# EAGLE design TuringMachine_singleBoard (EAGLE 6.6.0)

## Sheet 1 of 3
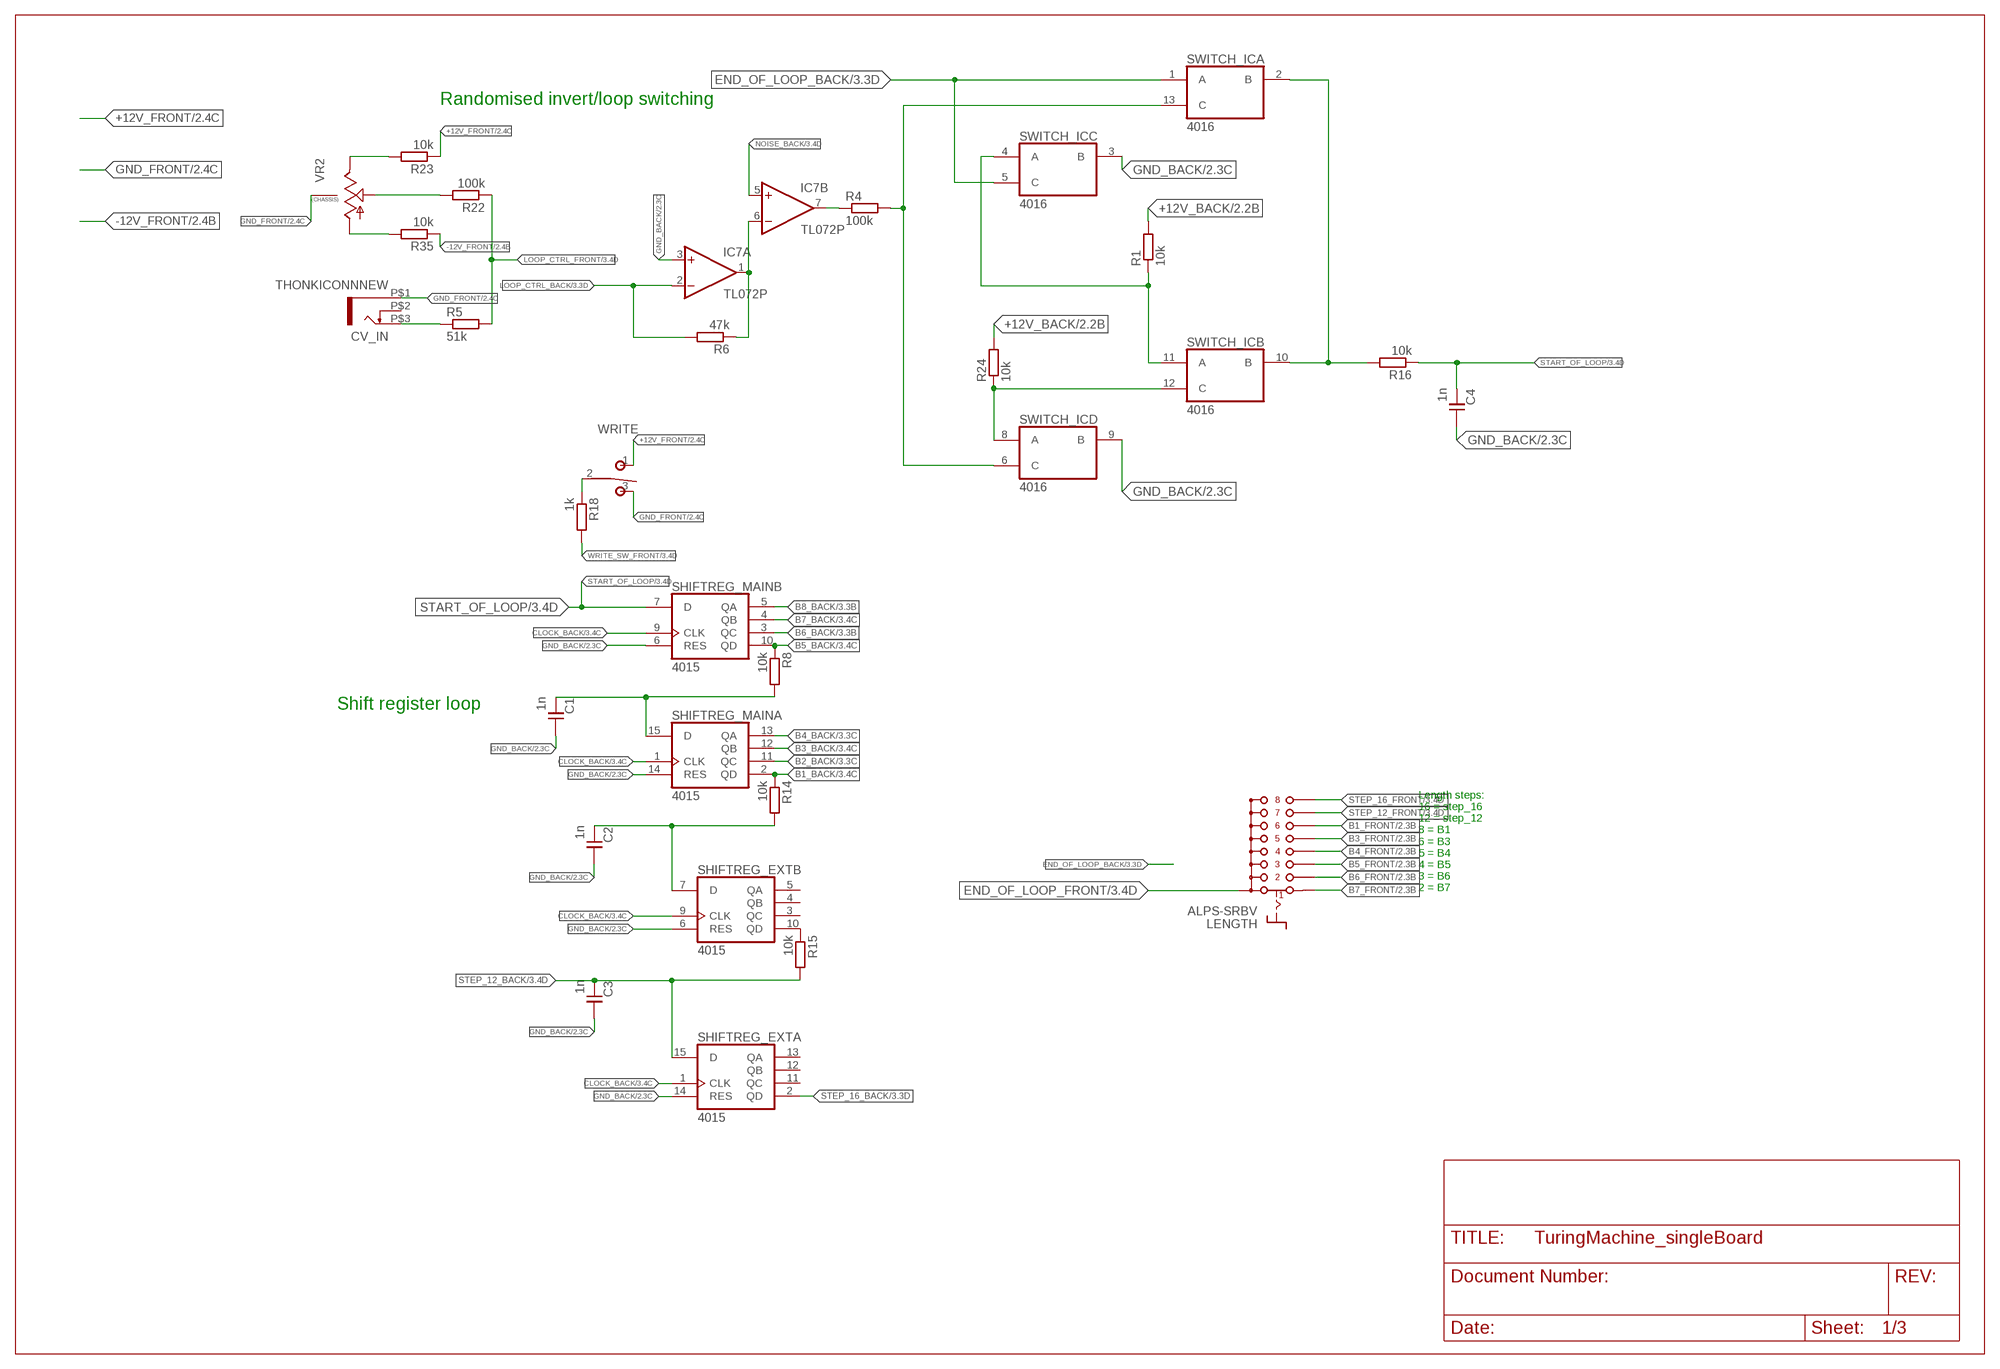
[diagram p0: schematic, sheet 1]

### Parts
C1  1n  C-EU050-024X044  [C050-024X044]
C2  1n  C-EU050-024X044  [C050-024X044]
C3  1n  C-EU050-024X044  [C050-024X044]
C4  1n  C-EU050-024X044  [C050-024X044]
CV_IN  THONKICONNNEW  [WQP-PJ301M-12_JACK]
IC7  TL072P  [DIL08]
LENGTH  ALPS-SRBV  [ALPS-SRBV]
R1  10k  R-EU_0207/7  [0207/7]
R4  100k  R-EU_0207/7  [0207/7]
R5  51k  R-EU_0207/7  [0207/7]
R6  47k  R-EU_0207/7  [0207/7]
R8  10k  R-EU_0207/7  [0207/7]
R14  10k  R-EU_0207/7  [0207/7]
R15  10k  R-EU_0207/7  [0207/7]
R16  10k  R-EU_0207/7  [0207/7]
R18  1k  R-EU_0207/7  [0207/7]
R22  100k  R-EU_0207/7  [0207/7]
R23  10k  R-EU_0207/7  [0207/7]
R24  10k  R-EU_0207/7  [0207/7]
R35  10k  R-EU_0207/7  [0207/7]
SHIFTREG_EXT  4015  4015N  [DIL16]
SHIFTREG_MAIN  4015  4015N  [DIL16]
SWITCH_IC  4016  4016N  [DIL14]
VR2  9MM_SNAP-IN_POT_CHASSIS  [9MM_SNAP-IN_POT]
WRITE  T-80-T-SPDT-ON-OFF-ON  [M9040P]

### Nets
+12V_BACK [power]: R1.2 R24.2 ; also sheet 2,3
+12V_FRONT [power]: R23.1 WRITE.1(O) ; also sheet 2,3
-12V_FRONT [power]: R35.1 ; also sheet 2,3
B1_BACK: R14.1 SHIFTREG_MAIN.2(A:QD) ; also sheet 3
B1_FRONT: LENGTH.F ; also sheet 2,3
B2_BACK: SHIFTREG_MAIN.11(A:QC) ; also sheet 3
B3_BACK: SHIFTREG_MAIN.12(A:QB) ; also sheet 3
B3_FRONT: LENGTH.E ; also sheet 2,3
B4_BACK: SHIFTREG_MAIN.13(A:QA) ; also sheet 3
B4_FRONT: LENGTH.D ; also sheet 2,3
B5_BACK: R8.1 SHIFTREG_MAIN.10(B:QD) ; also sheet 3
B5_FRONT: LENGTH.C ; also sheet 2,3
B6_BACK: SHIFTREG_MAIN.3(B:QC) ; also sheet 3
B6_FRONT: LENGTH.B ; also sheet 2,3
B7_BACK: SHIFTREG_MAIN.4(B:QB) ; also sheet 3
B7_FRONT: LENGTH.A ; also sheet 2,3
B8_BACK: SHIFTREG_MAIN.5(B:QA) ; also sheet 3
CLOCK_BACK: SHIFTREG_EXT.1(A:CLK) SHIFTREG_EXT.9(B:CLK) SHIFTREG_MAIN.1(A:CLK) SHIFTREG_MAIN.9(B:CLK) ; also sheet 3
END_OF_LOOP_BACK: SWITCH_IC.1(A:A) SWITCH_IC.5(C:C) ; also sheet 3
END_OF_LOOP_FRONT: LENGTH.COM2(A) LENGTH.COM(A) ; also sheet 3
GND_BACK [ground]: C1.1 C2.1 C3.1 C4.1 IC7.3(A:+IN) SHIFTREG_EXT.6(B:RES) SHIFTREG_EXT.14(A:RES) SHIFTREG_MAIN.6(B:RES) SHIFTREG_MAIN.14(A:RES) SWITCH_IC.3(C:B) SWITCH_IC.9(D:B) ; also sheet 2,3
GND_FRONT [ground]: CV_IN.P$1 VR2.M1 VR2.M2 WRITE.3(S) ; also sheet 2,3
LOOP_CTRL_BACK: IC7.2(A:-IN) R4.2 R6.2 SWITCH_IC.6(D:C) SWITCH_IC.13(A:C) ; also sheet 3
LOOP_CTRL_FRONT [power]: R5.2 R22.1 ; also sheet 3
N$1: IC7.7(B:OUT) R4.1
N$3: CV_IN.P$3 R5.1
N$4: R1.1 SWITCH_IC.4(C:A) SWITCH_IC.11(B:A)
N$7: IC7.1(A:OUT) IC7.6(B:-IN) R6.1
N$10: C1.2 R8.2 SHIFTREG_MAIN.15(A:D)
N$11: R18.1 WRITE.2(P)
N$14: R15.1 SHIFTREG_EXT.10(B:QD)
N$17: R16.2 SWITCH_IC.2(A:B) SWITCH_IC.10(B:B)
N$28: C2.2 R14.2 SHIFTREG_EXT.7(B:D)
N$43: R22.2 VR2.2(S)
N$45: R24.1 SWITCH_IC.8(D:A) SWITCH_IC.12(B:C)
N$47: R23.2 VR2.3(E)
N$48: R35.2 VR2.1(A)
NOISE_BACK: IC7.5(B:+IN) ; also sheet 3
START_OF_LOOP: C4.2 R16.1 SHIFTREG_MAIN.7(B:D) ; also sheet 3
STEP_12_BACK: C3.2 R15.2 SHIFTREG_EXT.15(A:D) ; also sheet 3
STEP_12_FRONT: LENGTH.G ; also sheet 3
STEP_16_BACK: SHIFTREG_EXT.2(A:QD) ; also sheet 3
STEP_16_FRONT: LENGTH.H ; also sheet 3
WRITE_SW_FRONT: R18.2 ; also sheet 3
Unconnected: CV_IN.P$2 SHIFTREG_EXT.3(B:QC) SHIFTREG_EXT.4(B:QB) SHIFTREG_EXT.5(B:QA) SHIFTREG_EXT.11(A:QC) SHIFTREG_EXT.12(A:QB) SHIFTREG_EXT.13(A:QA)

### Notes on the sheet
- Randomised invert/loop switching
- Shift register loop
- Length steps: 
  16 = step_16
  12 = step_12
  8 = B1 
  6 = B3
  5 = B4 
  4 = B5
  3 = B6
  2 = B7

## Sheet 2 of 3
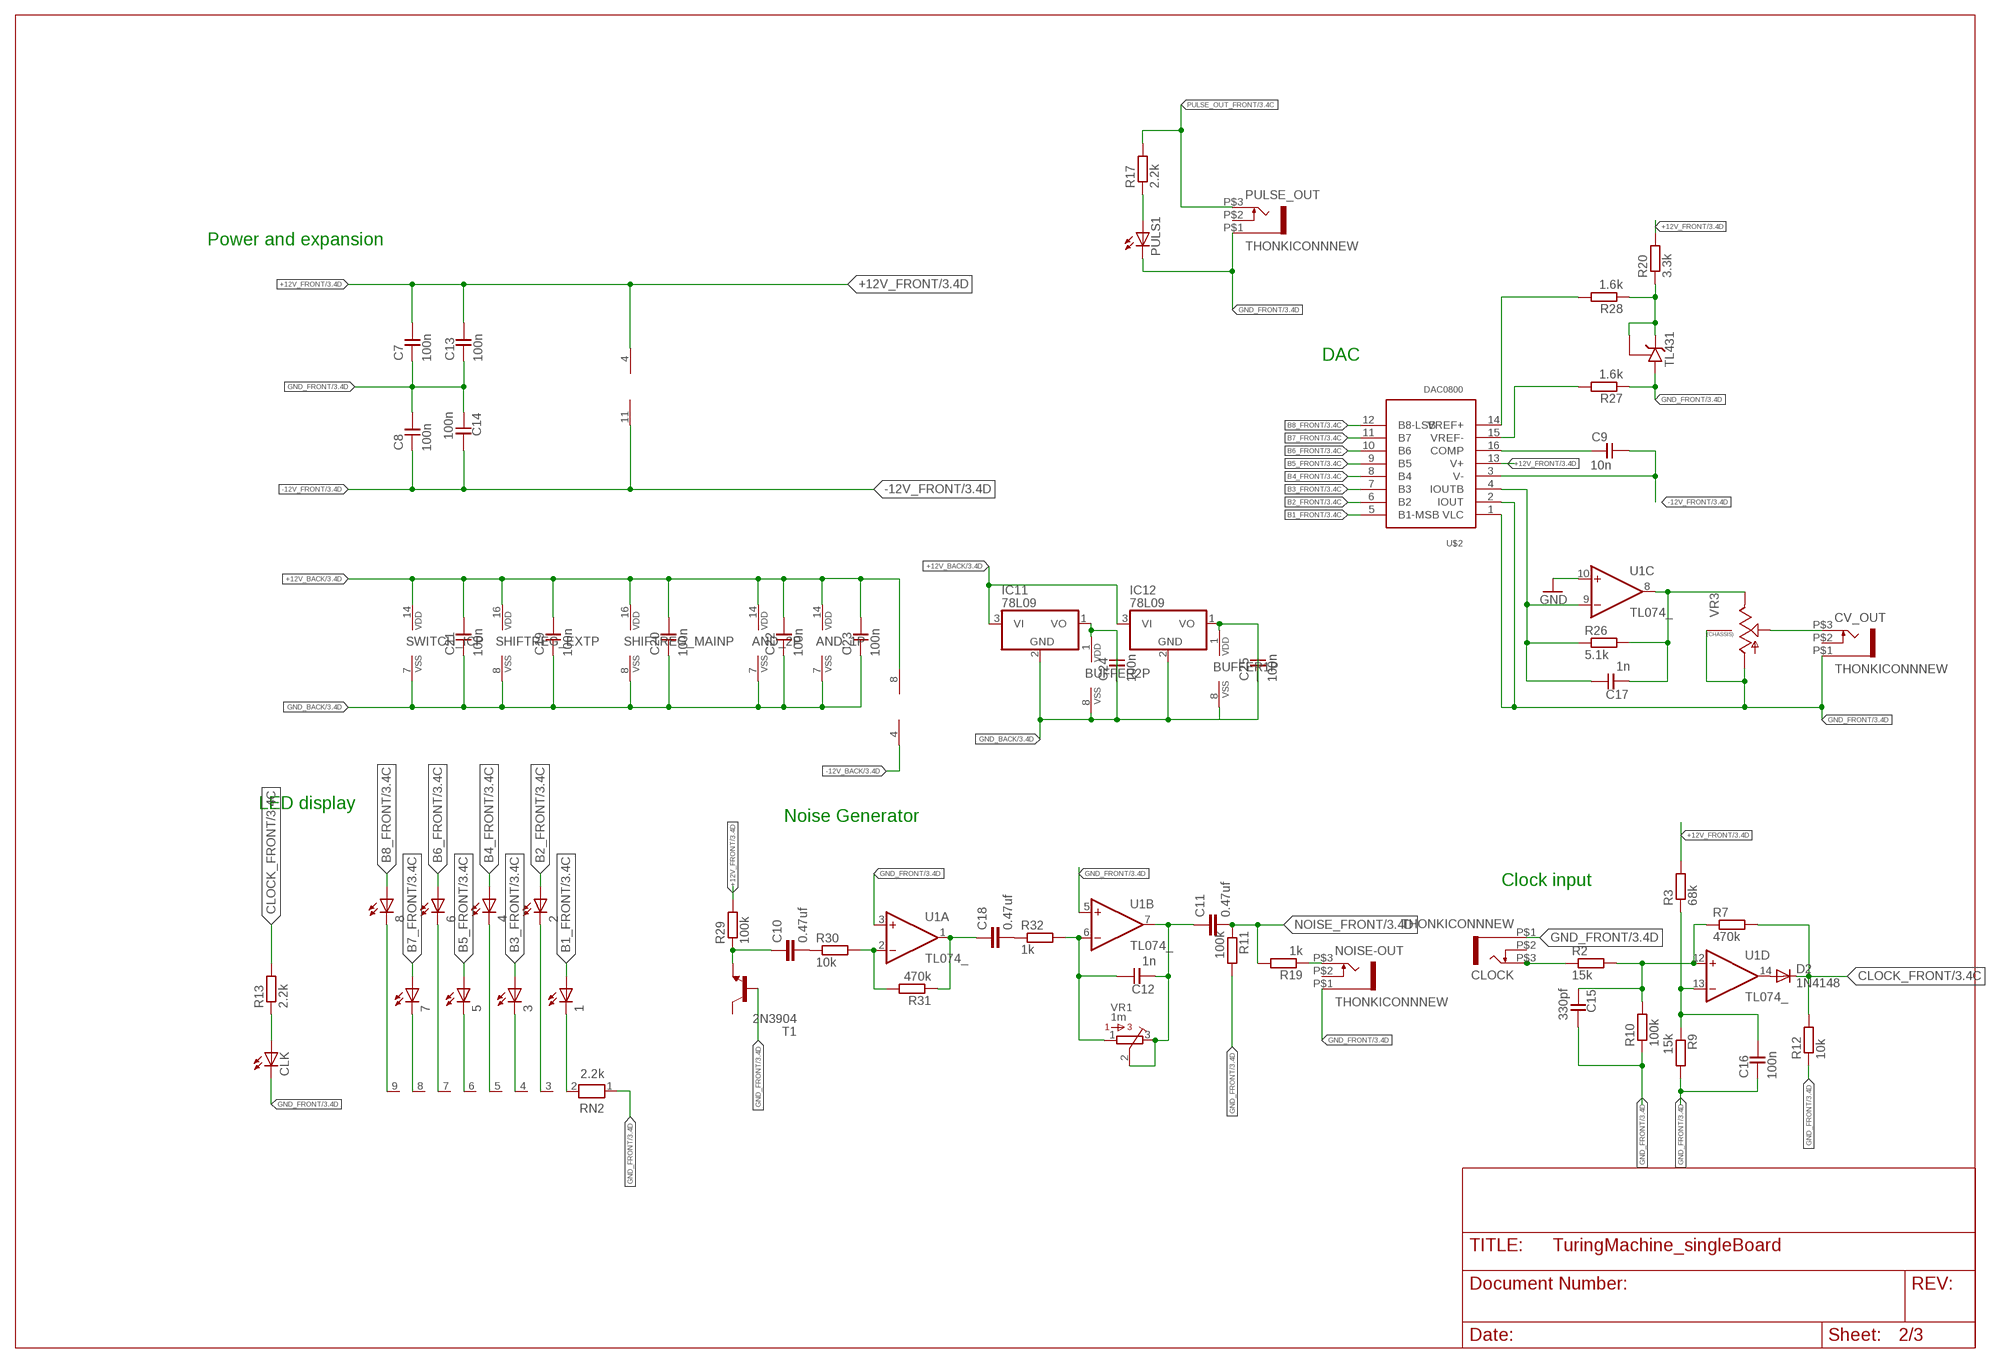
[diagram p1: schematic, sheet 2]

### Parts
1  LED3MM  [LED3MM]
2  LED3MM  [LED3MM]
3  LED3MM  [LED3MM]
4  LED3MM  [LED3MM]
5  LED3MM  [LED3MM]
6  LED3MM  [LED3MM]
7  LED3MM  [LED3MM]
8  LED3MM  [LED3MM]
AND_1  4081  4081N  [DIL14]
AND_2  4081  4081N  [DIL14]
BUFFER1  4050  4050N  [DIL16]
BUFFER2  4050  4050N  [DIL16]
C7  100n  C-EU050-024X044  [C050-024X044]
C8  100n  C-EU050-024X044  [C050-024X044]
C9  10n  C-EU050-024X044  [C050-024X044]
C10  0.47uf  C-EU050-035X075  [C050-035X075]
C11  0.47uf  C-EU050-035X075  [C050-035X075]
C12  1n  C-EU050-024X044  [C050-024X044]
C13  100n  C-EU050-024X044  [C050-024X044]
C14  100n  C-EU050-024X044  [C050-024X044]
C15  330pf  C-EU050-024X044  [C050-024X044]
C16  100n  C-EU050-024X044  [C050-024X044]
C17  1n  C-EU050-024X044  [C050-024X044]
C18  0.47uf  C-EU050-035X075  [C050-035X075]
C19  100n  C-EU050-024X044  [C050-024X044]
C20  100n  C-EU050-024X044  [C050-024X044]
C21  100n  C-EU050-024X044  [C050-024X044]
C22  100n  C-EU050-024X044  [C050-024X044]
C23  100n  C-EU050-024X044  [C050-024X044]
C24  100n  C-EU050-024X044  [C050-024X044]
C25  100n  C-EU050-024X044  [C050-024X044]
CLK  LED3MM  [LED3MM]
CLOCK  THONKICONNNEW  [WQP-PJ301M-12_JACK]
CV_OUT  THONKICONNNEW  [WQP-PJ301M-12_JACK]
D2  1N4148  SMALL_DIODEDO35-7  [DO35-7]
IC11  78L09  7808L  [TO92]
IC12  78L09  7808L  [TO92]
NOISE-OUT  THONKICONNNEW  [WQP-PJ301M-12_JACK]
PULS1  LED3MM  [LED3MM]
PULSE_OUT  THONKICONNNEW  [WQP-PJ301M-12_JACK]
R2  15k  R-EU_0207/7  [0207/7]
R3  68k  R-EU_0207/7  [0207/7]
R7  470k  R-EU_0207/7  [0207/7]
R9  15k  R-EU_0207/7  [0207/7]
R10  100k  R-EU_0207/7  [0207/7]
R11  100k  RESISTOR7MM  [7MM_RESISTOR]
R12  10k  R-EU_0207/7  [0207/7]
R13  2.2k  R-EU_0207/7  [0207/7]
R17  2.2k  R-EU_0207/7  [0207/7]
R19  1k  R-EU_0207/7  [0207/7]
R20  3.3k  R-EU_0207/7  [0207/7]
R26  5.1k  R-EU_0207/7  [0207/7]
R27  1.6k  R-EU_0207/7  [0207/7]
R28  1.6k  R-EU_0207/7  [0207/7]
R29  100k  R-EU_0207/7  [0207/7]
R30  10k  R-EU_0207/7  [0207/7]
R31  470k  R-EU_0207/7  [0207/7]
R32  1k  R-EU_0207/7  [0207/7]
RN2  2.2k  RN08  [RN-9]
T1  2N3904  [TO92]
TL431  TL431CLP  [TO92-CLP]
U1  TL074_  [DIL14]
U$2  DAC0800  [DIL16]
VR1  1m  BOURNS_3362P_TRIMMERP  [BOURNS_3362P_TRIMMER]
VR3  9MM_SNAP-IN_POT_CHASSIS  [9MM_SNAP-IN_POT]

### Nets
+9V_1 [power]: BUFFER2.1(P:VDD) C24.2 IC11.1(VO)
+9V_2 [power]: BUFFER1.1(P:VDD) C25.2 IC12.1(VO)
+12V_BACK [power]: AND_1.14(P:VDD) AND_2.14(P:VDD) C19.1 C20.1 C21.1 C22.1 C23.1 IC7.8(P:V+) IC11.3(VI) IC12.3(VI) SHIFTREG_EXT.16(P:VDD) SHIFTREG_MAIN.16(P:VDD) SWITCH_IC.14(P:VDD) ; also sheet 1,3
+12V_FRONT [power]: C7.1 C13.1 R3.2 R20.2 R29.2 U1.4(P:V+) U$2.13(V+) ; also sheet 1,3
-12V_BACK [power]: IC7.4(P:V-) ; also sheet 3
-12V_FRONT [power]: C8.2 C9.1 C14.1 U1.11(P:V-) U$2.3(V-) ; also sheet 1,3
B1_FRONT: 1.A U$2.5(B1-MSB) ; also sheet 1,3
B2_FRONT: 2.A U$2.6(B2) ; also sheet 3
B3_FRONT: 3.A U$2.7(B3) ; also sheet 1,3
B4_FRONT: 4.A U$2.8(B4) ; also sheet 1,3
B5_FRONT: 5.A U$2.9(B5) ; also sheet 1,3
B6_FRONT: 6.A U$2.10(B6) ; also sheet 1,3
B7_FRONT: 7.A U$2.11(B7) ; also sheet 1,3
B8_FRONT: 8.A U$2.12(B8-LSB) ; also sheet 3
CLOCK_FRONT: D2.C R7.2 R12.2 R13.2 ; also sheet 3
GND_BACK [ground]: AND_1.7(P:VSS) AND_2.7(P:VSS) BUFFER1.8(P:VSS) BUFFER2.8(P:VSS) C19.2 C20.2 C21.2 C22.2 C23.2 C24.1 C25.1 IC11.2(GND) IC12.2(GND) SHIFTREG_EXT.8(P:VSS) SHIFTREG_MAIN.8(P:VSS) SWITCH_IC.7(P:VSS) ; also sheet 1,3
GND_FRONT [ground]: C7.2 C8.1 C13.2 C14.2 C15.1 C16.2 CLK.K(C) CLOCK.P$1 CV_OUT.P$1 NOISE-OUT.P$1 PULS1.K(C) PULSE_OUT.P$1 R9.2 R10.1 R11.2 R12.1 R27.1 RN2.1 T1.2(B) TL431.A U1.3(A:+IN) U1.5(B:+IN) U1.10(C:+IN) U$2.1(VLC) U$2.2(IOUT) VR3.1(A) VR3.M1 VR3.M2 ; supply symbol labelled GND ; also sheet 1,3
MAIN_OUT: C17.2 R26.2 U1.8(C:OUT) VR3.3(E)
N$2: CLOCK.P$3 R2.1
N$5: C15.2 R2.2 R7.1 R10.2 U1.12(D:+IN)
N$6: PULS1.A R17.1
N$8: D2.A U1.14(D:OUT)
N$9: C18.2 R32.1
N$12: C16.1 R3.1 R9.1 U1.13(D:-IN)
N$13: C17.1 R26.1 U1.9(C:-IN) U$2.4(IOUTB)
N$15: CLK.A R13.1
N$16: C10.1 R29.1 T1.3(E)
N$18 [power]: R20.1 R28.1 TL431.C TL431.R
N$20: C10.2 R30.1
N$21: R30.2 R31.2 U1.2(A:-IN)
N$22: C18.1 R31.1 U1.1(A:OUT)
N$23: R27.2 U$2.15(VREF-)
N$25: C9.2 U$2.16(COMP)
N$26: R28.2 U$2.14(VREF+)
N$27: C12.1 R32.2 U1.6(B:-IN) VR1.1
N$30: 8.K(C) RN2.9
N$31: 7.K(C) RN2.8
N$32: 6.K(C) RN2.7
N$33: 5.K(C) RN2.6
N$34: 4.K(C) RN2.5
N$35: 3.K(C) RN2.4
N$36: 2.K(C) RN2.3
N$37: 1.K(C) RN2.2
N$39: CV_OUT.P$3 VR3.2(S)
N$40: NOISE-OUT.P$3 R19.1
N$41: C11.1 C12.2 U1.7(B:OUT) VR1.2 VR1.3
NOISE_FRONT: C11.2 R11.1 R19.2 ; also sheet 3
PULSE_OUT_FRONT: PULSE_OUT.P$3 R17.2 ; also sheet 3
Unconnected: CLOCK.P$2 CV_OUT.P$2 NOISE-OUT.P$2 PULSE_OUT.P$2 T1.1(C)

### Notes on the sheet
- Power and expansion
- DAC
- LED display
- Noise Generator
- Clock input
- /Users/aash/Dropbox/Electronics/!MODULAR/design/logo copy.bmp

## Sheet 3 of 3
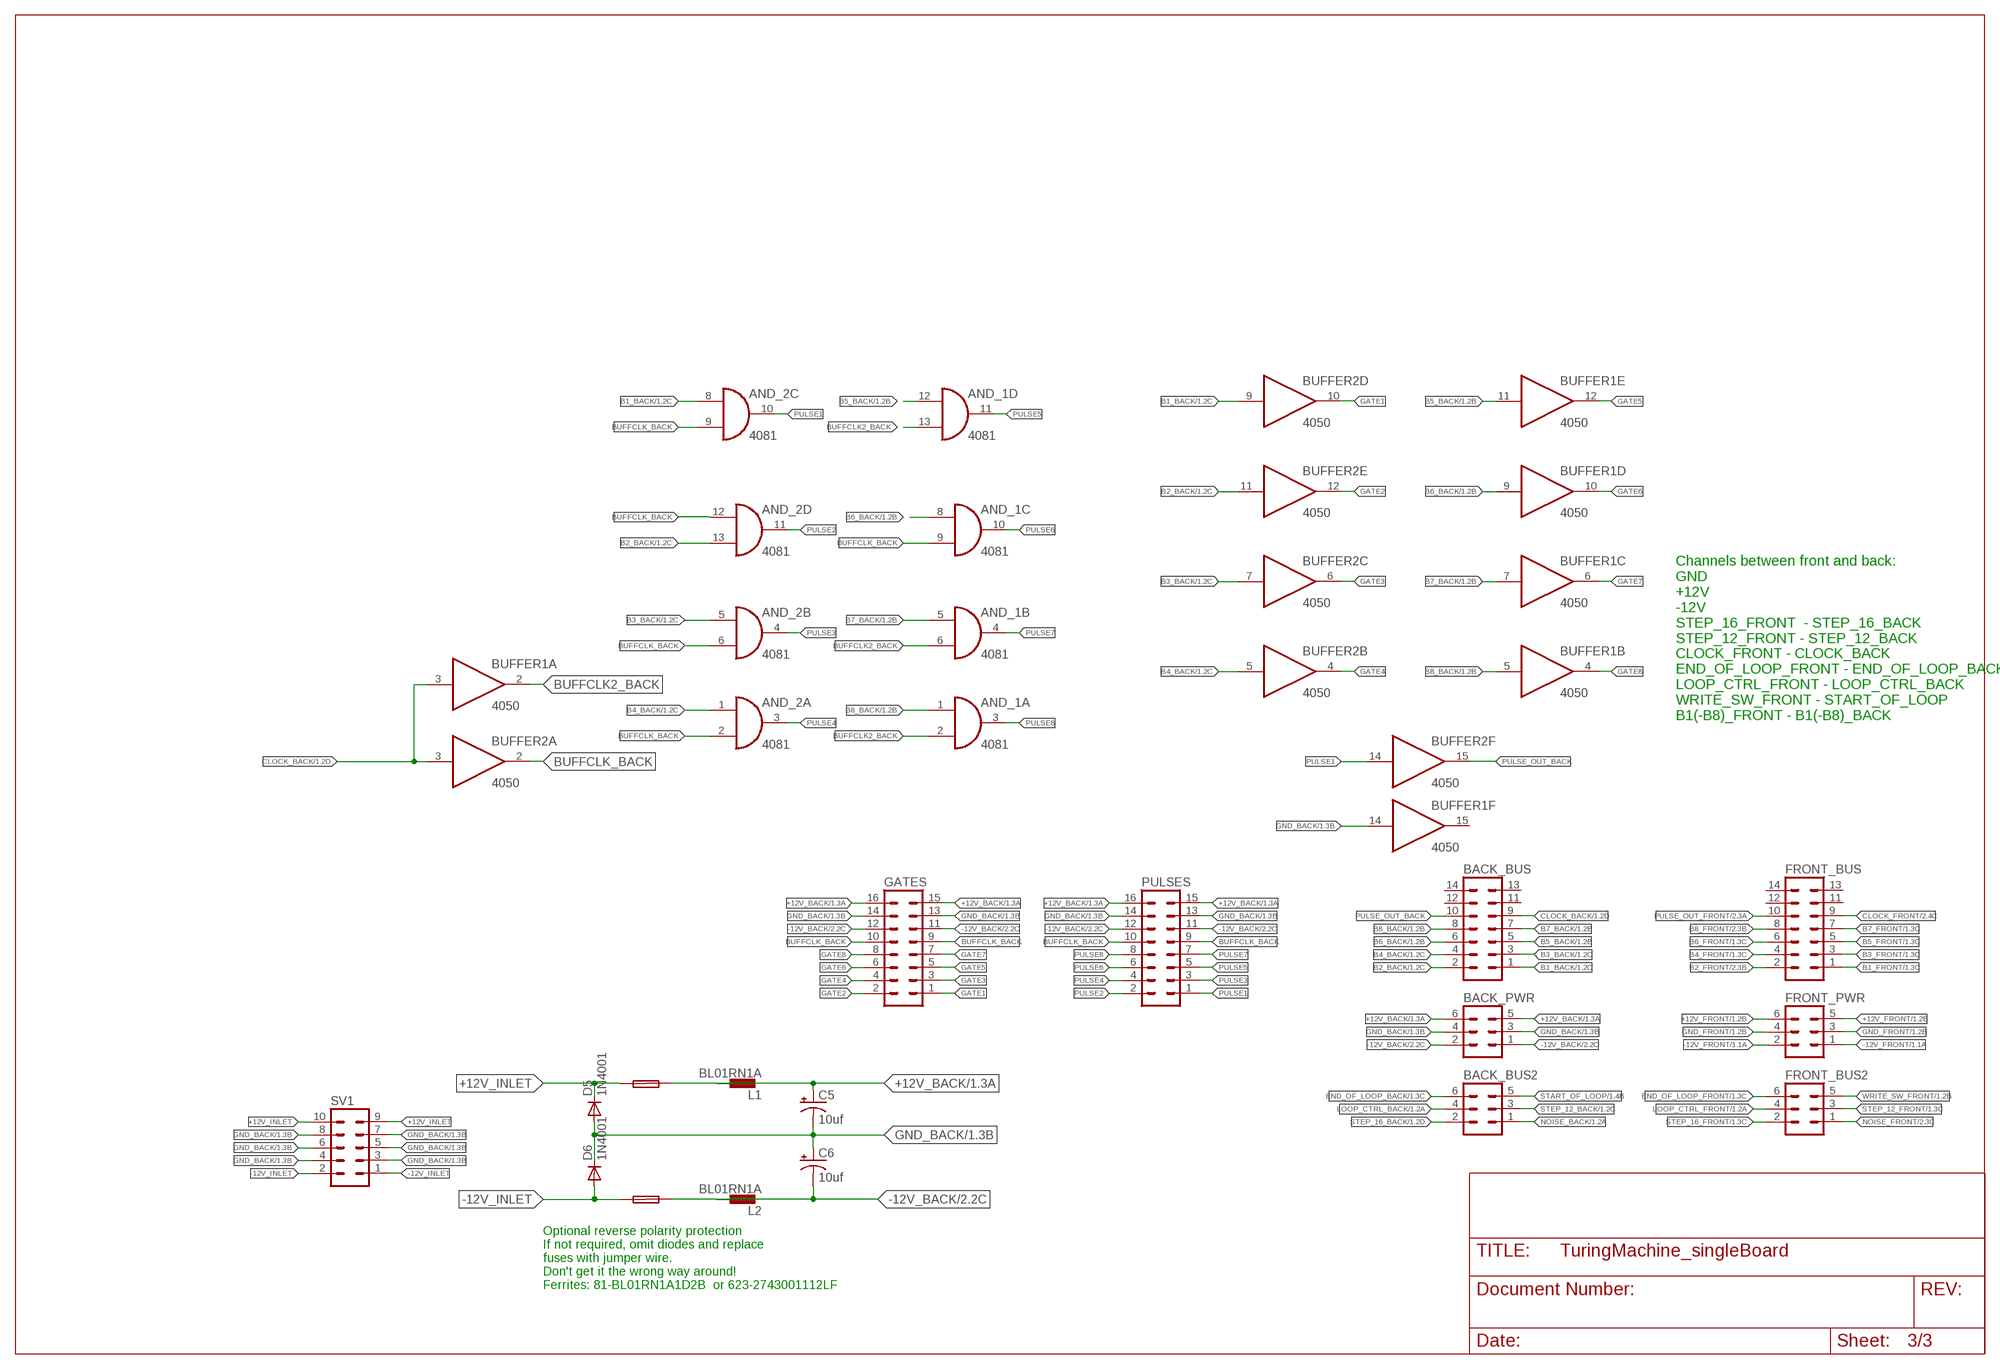
[diagram p2: schematic, sheet 3]

### Parts
BACK_BUS  MA07-2_BACKSIDEFRONTSIDE  [MA07-2]
BACK_BUS2  MA03-2  [MA03-2]
BACK_PWR  MA03-2  [MA03-2]
C5  10uf  CAP_POLPTH2  [CPOL-RADIAL-10UF-25V]
C6  10uf  CAP_POLPTH2  [CPOL-RADIAL-10UF-25V]
D5  1N4001  1N4004  [DO41-10]
D6  1N4001  1N4004  [DO41-10]
F1  FUSE  PTC_FUSEPOLY_FUSE  [C050H075X075]
F2  FUSE  PTC_FUSEPOLY_FUSE  [C050H075X075]
FRONT_BUS  MA07-2_BACKSIDEBACKSIDE  [MA07-2_BACKSIDE]
FRONT_BUS2  MA03-2BACKSIDE  [MA03-2BACKSIDE]
FRONT_PWR  MA03-2BACKSIDE  [MA03-2BACKSIDE]
GATES  MA08-2  [MA08-2]
L1  BL01RN1A  [BL01RN1A]
L2  BL01RN1A  [BL01RN1A]
PULSES  MA08-2  [MA08-2]
SV1  10_PIN_HEADER  [MA05-2]

### Nets
+12V_BACK [power]: BACK_PWR.5 BACK_PWR.6 C5.1(+) GATES.15 GATES.16 L1.2 PULSES.15 PULSES.16 ; also sheet 1,2
+12V_FRONT [power]: FRONT_PWR.5 FRONT_PWR.6 ; also sheet 1,2
+12V_INLET [power]: D5.C F1.1 SV1.9 SV1.10
-12V_BACK [power]: BACK_PWR.1 BACK_PWR.2 C6.2(-) GATES.11 GATES.12 L2.2 PULSES.11 PULSES.12 ; also sheet 2
-12V_FRONT [power]: FRONT_PWR.1 FRONT_PWR.2 ; also sheet 1,2
-12V_INLET [power]: D6.A F2.1 SV1.1 SV1.2
B1_BACK: AND_2.8(C:I0) BACK_BUS.1 BUFFER2.9(D:I) ; also sheet 1
B1_FRONT: FRONT_BUS.1 ; also sheet 1,2
B2_BACK: AND_2.13(D:I1) BACK_BUS.2 BUFFER2.11(E:I) ; also sheet 1
B2_FRONT: FRONT_BUS.2 ; also sheet 2
B3_BACK: AND_2.5(B:I0) BACK_BUS.3 BUFFER2.7(C:I) ; also sheet 1
B3_FRONT: FRONT_BUS.3 ; also sheet 1,2
B4_BACK: AND_2.1(A:I0) BACK_BUS.4 BUFFER2.5(B:I) ; also sheet 1
B4_FRONT: FRONT_BUS.4 ; also sheet 1,2
B5_BACK: AND_1.12(D:I0) BACK_BUS.5 BUFFER1.11(E:I) ; also sheet 1
B5_FRONT: FRONT_BUS.5 ; also sheet 1,2
B6_BACK: AND_1.8(C:I0) BACK_BUS.6 BUFFER1.9(D:I) ; also sheet 1
B6_FRONT: FRONT_BUS.6 ; also sheet 1,2
B7_BACK: AND_1.5(B:I0) BACK_BUS.7 BUFFER1.7(C:I) ; also sheet 1
B7_FRONT: FRONT_BUS.7 ; also sheet 1,2
B8_BACK: AND_1.1(A:I0) BACK_BUS.8 BUFFER1.5(B:I) ; also sheet 1
B8_FRONT: FRONT_BUS.8 ; also sheet 2
BUFFCLK2_BACK: AND_1.2(A:I1) AND_1.6(B:I1) AND_1.13(D:I1) BUFFER1.2(A:O)
BUFFCLK_BACK: AND_1.9(C:I1) AND_2.2(A:I1) AND_2.6(B:I1) AND_2.9(C:I1) AND_2.12(D:I0) BUFFER2.2(A:O) GATES.9 GATES.10 PULSES.9 PULSES.10
CLOCK_BACK: BACK_BUS.9 BUFFER1.3(A:I) BUFFER2.3(A:I) ; also sheet 1
CLOCK_FRONT: FRONT_BUS.9 ; also sheet 2
END_OF_LOOP_BACK: BACK_BUS2.6 ; also sheet 1
END_OF_LOOP_FRONT: FRONT_BUS2.6 ; also sheet 1
GATE1: BUFFER2.10(D:O) GATES.1
GATE2: BUFFER2.12(E:O) GATES.2
GATE3: BUFFER2.6(C:O) GATES.3
GATE4: BUFFER2.4(B:O) GATES.4
GATE5: BUFFER1.12(E:O) GATES.5
GATE6: BUFFER1.10(D:O) GATES.6
GATE7: BUFFER1.6(C:O) GATES.7
GATE8: BUFFER1.4(B:O) GATES.8
GND_BACK [ground]: BACK_PWR.3 BACK_PWR.4 BUFFER1.14(F:I) C5.2(-) C6.1(+) D5.A D6.C GATES.13 GATES.14 PULSES.13 PULSES.14 SV1.3 SV1.4 SV1.5 SV1.6 SV1.7 SV1.8 ; also sheet 1,2
GND_FRONT [ground]: FRONT_PWR.3 FRONT_PWR.4 ; also sheet 1,2
LOOP_CTRL_BACK: BACK_BUS2.4 ; also sheet 1
LOOP_CTRL_FRONT [power]: FRONT_BUS2.4 ; also sheet 1
N$42 [power]: F1.2 L1.1
N$44 [power]: F2.2 L2.1
NOISE_BACK: BACK_BUS2.1 ; also sheet 1
NOISE_FRONT: FRONT_BUS2.1 ; also sheet 2
PULSE1: AND_2.10(C:O) BUFFER2.14(F:I) PULSES.1
PULSE2: AND_2.11(D:O) PULSES.2
PULSE3: AND_2.4(B:O) PULSES.3
PULSE4: AND_2.3(A:O) PULSES.4
PULSE5: AND_1.11(D:O) PULSES.5
PULSE6: AND_1.10(C:O) PULSES.6
PULSE7: AND_1.4(B:O) PULSES.7
PULSE8: AND_1.3(A:O) PULSES.8
PULSE_OUT_BACK: BACK_BUS.10 BUFFER2.15(F:O)
PULSE_OUT_FRONT: FRONT_BUS.10 ; also sheet 2
START_OF_LOOP: BACK_BUS2.5 ; also sheet 1
STEP_12_BACK: BACK_BUS2.3 ; also sheet 1
STEP_12_FRONT: FRONT_BUS2.3 ; also sheet 1
STEP_16_BACK: BACK_BUS2.2 ; also sheet 1
STEP_16_FRONT: FRONT_BUS2.2 ; also sheet 1
WRITE_SW_FRONT: FRONT_BUS2.5 ; also sheet 1
Unconnected: BACK_BUS.11 BACK_BUS.12 BACK_BUS.13 BACK_BUS.14 BUFFER1.15(F:O) FRONT_BUS.11 FRONT_BUS.12 FRONT_BUS.13 FRONT_BUS.14

### Notes on the sheet
- Channels between front and back: 
  GND
  +12V
  -12V
  STEP_16_FRONT  - STEP_16_BACK
  STEP_12_FRONT - STEP_12_BACK
  CLOCK_FRONT - CLOCK_BACK 
  END_OF_LOOP_FRONT - END_OF_LOOP_BACKRL
  LOOP_CTRL_FRONT - LOOP_CTRL_BACK
  WRITE_SW_FRONT - START_OF_LOOP
  B1(-B8)_FRONT - B1(-B8)_BACK
- Optional reverse polarity protection
  If not required, omit diodes and replace
  fuses with jumper wire. 
  Don't get it the wrong way around! 
  Ferrites: 81-BL01RN1A1D2B  or 623-2743001112LF

## Library data of the parts
1-8 CLK PULS1 = TomW:LED: LED OSRAM: - CHIPLED LG R971, LG N971, LY N971, LG Q971, LY Q971, LO R971, LY R971 LH N974, LH R974 LS Q976, LO Q976, LY Q976 LO Q996 - Hyper CHIPLED LW Q18S LB Q993, LB Q99A, LB R99A - SideLED LS A670, LO A670, LY A670, LG A670, LP A670 LB A673, LV A673, LT A673, LW A673 LH A674 LY A675 LS A676, LA A676, LO A676, LY A676, LW A676 LS A679, LY A679, LG A679 - Hyper Micro SIDELED® LS Y876, LA Y876, LO Y876, LY Y876 LT Y87S - SmartLED LW L88C, LW L88S LB L89C, LB L89S, LG L890 LS L89K, LO L89K, LY L89K LS L896, LA L896, LO L896, LY L896 - TOPLED LS T670, LO T670, LY T670, LG T670, LP T670 LSG T670, LSP T670, LSY T670, LOP T670, LYG T670 LG T671, LOG T671, LSG T671 LB T673, LV T673, LT T673, LW T673 LH T674 LS T676, LA T676, LO T676, LY T676, LB T676, LH T676, LSB T676, LW T676 LB T67C, LV T67C, LT T67C, LS T67K, LO T67K, LY T67K, LW E67C LS E67B, LA E67B, LO E67B, LY E67B, LB E67C, LV E67C, LT E67C LW T67C LS T679, LY T679, LG T679 LS T770, LO T770, LY T770, LG T770, LP T770 LB T773, LV T773, LT T773, LW T773 LH T774 LS E675, LA E675, LY E675, LS T675 LS T776, LA T776, LO T776, LY T776, LB T776 LHGB T686 LT T68C, LB T68C - Hyper Mini TOPLED® LB M676 - Mini TOPLED Santana® LG M470 LS M47K, LO M47K, LY M47K Source: http://www.osram.convergy.de LUXEON: - LUMILED® LXK2-PW12-R00, LXK2-PW12-S00, LXK2-PW14-U00, LXK2-PW14-V00 LXK2-PM12-R00, LXK2-PM12-S00, LXK2-PM14-U00 LXK2-PE12-Q00, LXK2-PE12-R00, LXK2-PE12-S00, LXK2-PE14-T00, LXK2-PE14-U00 LXK2-PB12-K00, LXK2-PB12-L00, LXK2-PB12-M00, LXK2-PB14-N00, LXK2-PB14-P00, LXK2-PB14-Q00 LXK2-PR12-L00, LXK2-PR12-M00, LXK2-PR14-Q00, LXK2-PR14-R00 LXK2-PD12-Q00, LXK2-PD12-R00, LXK2-PD12-S00 LXK2-PH12-R00, LXK2-PH12-S00 LXK2-PL12-P00, LXK2-PL12-Q00, LXK2-PL12-R00 Source: www.luxeon.com KINGBRIGHT: KA-3528ASYC Source: www.kingbright.com
AND_1 AND_2 = 40xx:4081: Quad 2-input AND
BACK_BUS = MusicThingModular:MA07-2_BACKSIDE: PIN HEADER; OC_FARNELL: unknown; OC_NEWARK: unknown
BACK_BUS2 BACK_PWR = con-lstb:MA03-2: PIN HEADER; OC_FARNELL: unknown; OC_NEWARK: unknown
BUFFER1 BUFFER2 = 40xx:4050: Hex non-inverting BUFFER
C1-C4 C7-C9 C12-C17 C19-C25 = TomW:C-EU: CAPACITOR, European symbol
C5 C6 = SparkFun-Passives:CAP_POL: Capacitor Polarized These are standard SMD and PTH capacitors. Normally 10uF, 47uF, and 100uF in electrolytic and tantalum varieties. Always verify the external diameter of the through hole cap, it varies with capacity, voltage, and manufacturer. The EIA devices should be standard.
C10 C11 C18 = rcl:C-EU: CAPACITOR, European symbol
CLOCK CV_IN CV_OUT NOISE-OUT PULSE_OUT = MusicThingModular:THONKICONN: 3.5mm socket for Eurorack modular synths
D2 = MusicThingModular:SMALL_DIODE: Small Signal Diode
D5 D6 = diode:1N4004: DIODE general purpose rectifier, 1 A
F1 F2 = TomW:PTC_FUSE
FRONT_BUS = MusicThingModular:MA07-2_BACKSIDE: PIN HEADER
FRONT_BUS2 FRONT_PWR = MusicThingModular:MA03-2BACKSIDE: PIN HEADER
GATES PULSES = con-lstb:MA08-2: PIN HEADER; OC_FARNELL: unknown; OC_NEWARK: unknown
IC7 = TomW:TL072: OP AMP
IC11 IC12 = linear:78*: Positive VOLTAGE REGULATOR Source: http://cache.national.com/ds/LM/LM78L05.pdf http://www.fairchildsemi.com/ds/LM/LM7805.pdf
L1 L2 = inductors:BL0: Noise Suppression Products/EMI Suppression Filters, Lead EMIFIL(R) Inductor Type Source: http://www.murata.com .. BL01RN1_DS.pdf
LENGTH = TomW:ALPS-SRBV
R1-R10 R12-R20 R22-R24 R26-R32 R35 = TomW:R-EU_: RESISTOR, European symbol
R11 = MusicThingModular:RESISTOR: Standard resistor, various versions
RN2 = resistor-net:RN08: RESISTOR NETWORK; OC_FARNELL: unknown; OC_NEWARK: unknown
SHIFTREG_EXT SHIFTREG_MAIN = 40xx:4015: Dual 4-bit static SHIFT REGISTER
SV1 = TomW:10_PIN_HEADER: PIN HEADER; OC_FARNELL: unknown; OC_NEWARK: unknown
SWITCH_IC = 40xx:4016: Quad bilateral ANALOG SWITCH
T1 = transistor:2N3904: NPN TRANSISTOR
TL431 = TomW:TL431CLP: VOLTAGE REGULATOR
U1 = MusicThingModular:TL074: Generic Quad Op Amp
U$2 = TomW:DAC0800
VR1 = MusicThingModular:BOURNS_3362P_TRIMMER: 3362 Series 1/4" Square Trimmer
VR2 VR3 = MusicThingModular:9MM_SNAP-IN_POT_CHASSIS: 9mm vertical snap-in pot, Alpha / Panasonic style, with a connection to the metal chassis for grounding
WRITE = TomW:T-80-T-SPDT-ON-OFF-ON

## Net classes
0 default: width 0.203 mm
1 power: width 0.406 mm
2 ground: width 0.406 mm

## Board
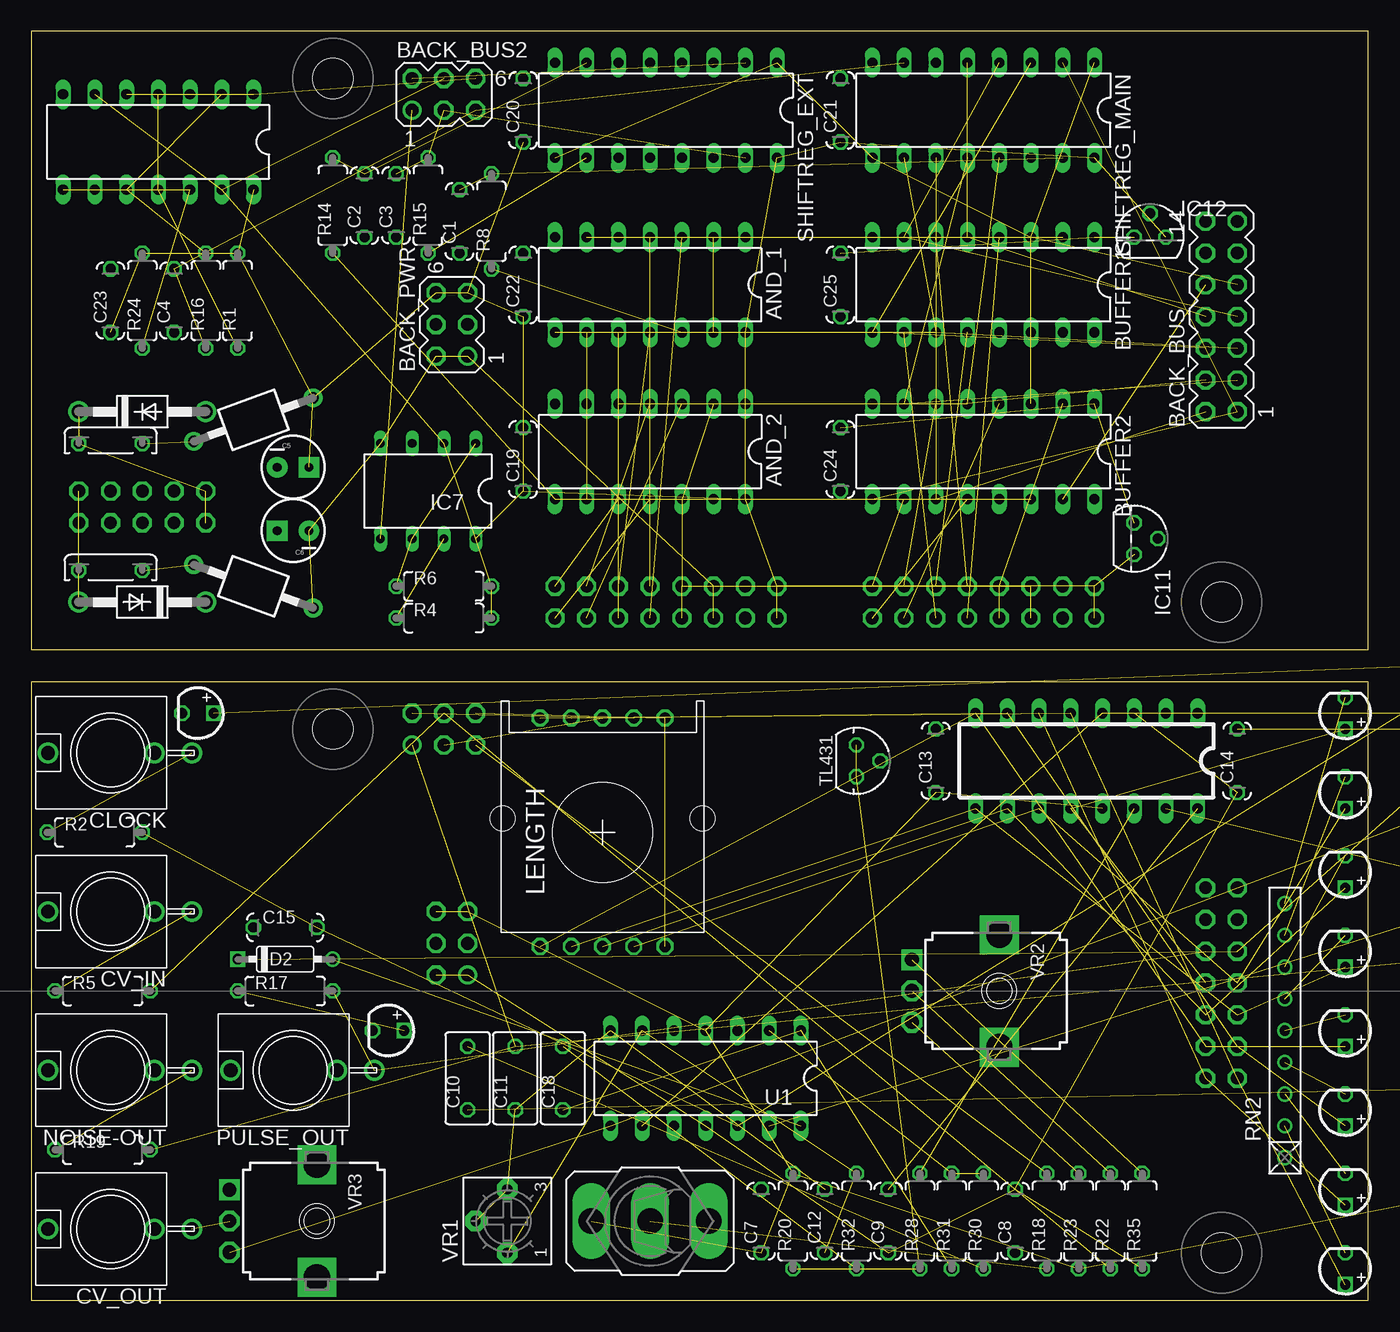
[diagram p3: board, top side]
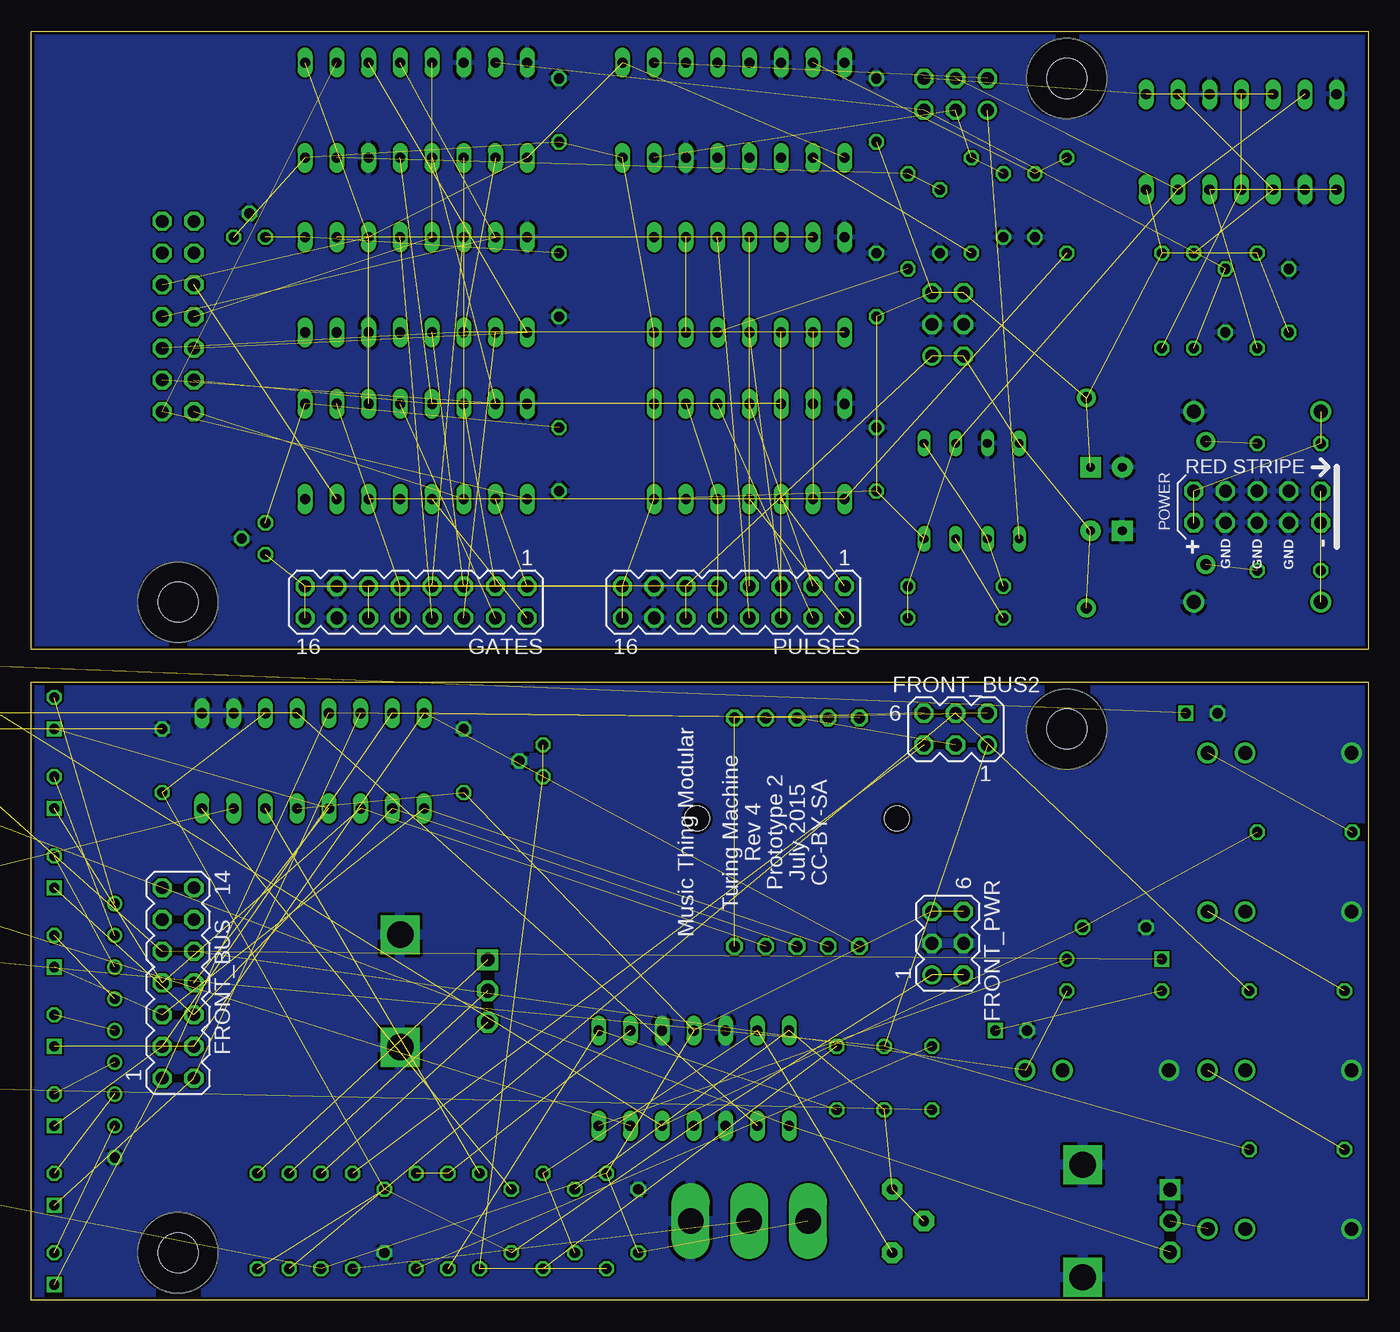
[diagram p4: board, bottom side, seen from below]

Size 107 x 101.57 mm. Coordinates in mm from the lower left corner, seen from the top.
Outline: 0,49.5 0,0 107,0 107,49.5 0,49.5
Outline: 0,101.57 0,52.07 107,52.07 107,101.57 0,101.57
Copper layers (1*2*15*16): Top 0.035mm / dielectric 0.2mm / Route2 0.0175mm / dielectric 1.1mm / Route15 0.0175mm / dielectric 0.2mm / Bottom 0.035mm
Design rules "SeeedStudio_DRU_no_angle_20130527": minimum track width 6mil, minimum drill 12mil, track to track 6mil, track to pad 6mil, pad to pad 6mil, via to via 6mil, smd to smd 0mil, copper to edge 10mil, drill to drill 10mil, minimum pad ring 6mil, minimum via ring 6mil, stop-mask expansion 2mil, vias tented up to drill 25mil, thermal gap 10mil

### Footprints (pad centres in the part's own frame; a part is rotated, then mirrored left to right if it is on the bottom)
LED3MM = drill 0.813 square: A -1.27,0 | drill 0.813 octagon: K 1.27,0
DIL14 = drill 0.813 long: 1 -7.62,-3.81; 2 -5.08,-3.81; 3 -2.54,-3.81; 4 0,-3.81; 5 2.54,-3.81; 6 5.08,-3.81; 7 7.62,-3.81; 8 7.62,3.81; 9 5.08,3.81; 10 2.54,3.81; 11 0,3.81; 12 -2.54,3.81; 13 -5.08,3.81; 14 -7.62,3.81
MA07-2 = drill 1.016 octagon: 1 -7.62,-1.27; 2 -7.62,1.27; 3 -5.08,-1.27; 4 -5.08,1.27; 5 -2.54,-1.27; 6 -2.54,1.27; 7 0,-1.27; 8 0,1.27; 9 2.54,-1.27; 10 2.54,1.27; 11 5.08,-1.27; 12 5.08,1.27; 13 7.62,-1.27; 14 7.62,1.27
MA03-2 = drill 1.016: 1 -2.54,-1.27 | drill 1.016 octagon: 2 -2.54,1.27; 3 0,-1.27; 4 0,1.27; 5 2.54,-1.27; 6 2.54,1.27
DIL16 = drill 0.813 long: 1 -8.89,-3.81; 2 -6.35,-3.81; 3 -3.81,-3.81; 4 -1.27,-3.81; 5 1.27,-3.81; 6 3.81,-3.81; 7 6.35,-3.81; 8 8.89,-3.81; 9 8.89,3.81; 10 6.35,3.81; 11 3.81,3.81; 12 1.27,3.81; 13 -1.27,3.81; 14 -3.81,3.81; 15 -6.35,3.81; 16 -8.89,3.81
C050-024X044 = drill 0.813 octagon: 1 -2.54,0; 2 2.54,0
CPOL-RADIAL-10UF-25V = drill 0.7 pad 1.651 square: 1 1.27,0 | drill 0.7 pad 1.651: 2 -1.27,0
C050-035X075 = drill 0.813 octagon: 1 -2.54,0; 2 2.54,0
WQP-PJ301M-12_JACK = drill 1.1: P$1 0,5; P$2 0,-3.5; P$3 0,-6.5
DO35-7 = drill 0.813: A 3.81,0 | drill 0.813 square: C -3.81,0
DO41-10 = drill 1.118: A 5.08,0; C -5.08,0
C050H075X075 = drill 0.813 octagon: 1 -2.54,0; 2 2.54,0
MA07-2_BACKSIDE = drill 1.016 octagon: 1 -7.62,-1.27; 2 -7.62,1.27; 3 -5.08,-1.27; 4 -5.08,1.27; 5 -2.54,-1.27; 6 -2.54,1.27; 7 0,-1.27; 8 0,1.27; 9 2.54,-1.27; 10 2.54,1.27; 11 5.08,-1.27; 12 5.08,1.27; 13 7.62,-1.27; 14 7.62,1.27
MA03-2BACKSIDE = drill 1.016: 1 -2.54,-1.27 | drill 1.016 octagon: 2 -2.54,1.27; 3 0,-1.27; 4 0,1.27; 5 2.54,-1.27; 6 2.54,1.27
MA08-2 = drill 1.016 octagon: 1 -8.89,-1.27; 2 -8.89,1.27; 3 -6.35,-1.27; 4 -6.35,1.27; 5 -3.81,-1.27; 6 -3.81,1.27; 7 -1.27,-1.27; 8 -1.27,1.27; 9 1.27,-1.27; 10 1.27,1.27; 11 3.81,-1.27; 12 3.81,1.27; 13 6.35,-1.27; 14 6.35,1.27; 15 8.89,-1.27; 16 8.89,1.27
DIL08 = drill 0.7 long: 1 -3.81,-3.81; 2 -1.27,-3.81; 3 1.27,-3.81; 4 3.81,-3.81; 5 3.81,3.81; 6 1.27,3.81; 7 -1.27,3.81; 8 -3.81,3.81
TO92 = drill 0.813 octagon: 1 -1.27,0; 2 0,1.905; 3 1.27,0
BL01RN1A = drill 0.9 pad 1.5: 1 -5.08,0; 2 5.08,0
ALPS-SRBV = drill 0.9 octagon: A 2.5,-9.15; B 0,-9.15; C -2.5,-9.15; COM 5,-9.15; COM2 5,9.15; D -5,-9.15; E -5,9.15; F -2.5,9.15; G 0,9.15; H 2.5,9.15 | hole 2: 8,1.1; -8,1.1
0207/7 = drill 0.813 octagon: 1 -3.81,0; 2 3.81,0
7MM_RESISTOR = drill 0.813 octagon: 1 -3.81,0; 2 3.81,0
RN-9 = drill 0.813: 1 -10.16,0; 2 -7.62,0; 3 -5.08,0; 4 -2.54,0; 5 0,0; 6 2.54,0; 7 5.08,0; 8 7.62,0; 9 10.16,0
MA05-2 = drill 1.016 octagon: 1 -5.08,-1.27; 2 -5.08,1.27; 3 -2.54,-1.27; 4 -2.54,1.27; 5 0,-1.27; 6 0,1.27; 7 2.54,-1.27; 8 2.54,1.27; 9 5.08,-1.27; 10 5.08,1.27
TO92' = drill 0.813 octagon: 1 1.27,0; 2 0,1.905; 3 -1.27,0
TO92-CLP = drill 0.813 octagon: A 0,1.905; C 1.27,0; R -1.27,0
MOUNTING_HOLE = hole 3.2: 0,0
BOURNS_3362P_TRIMMER = drill 0.813 pad 1.676 octagon: 1 -2.54,0; 2 0,2.54; 3 2.54,0
9MM_SNAP-IN_POT = drill 1.1 pad 1.676 square: 1 -2.5,-7 | drill 1.1 pad 1.676 octagon: 2 0,-7; 3 2.5,-7 | drill 2.1 pad 2.8 square: M1 4.5,0; M2 -4.5,0
M9040P = drill 2.03 long: 1 0,4.699; 2 0,0; 3 0,-4.699

### Placement (x,y rotation side)
1  105.16,2.54 90 top
2  105.16,8.89 90 top
3  105.16,15.24 90 top
4  105.16,21.59 90 top
5  105.16,27.94 90 top
6  105.16,34.29 90 top
7  105.16,40.64 90 top
8  105.16,46.99 90 top
AND_1  49.53,81.28 180 top
AND_2  49.53,67.94 180 top
BACK_BUS  95.25,78.74 90 top
BACK_BUS2  33.02,96.52 0 top
BACK_PWR  33.66,78.11 90 top
BUFFER1  76.2,81.28 180 top
BUFFER2  76.2,67.94 180 top
C1  34.29,86.36 90 top
C2  26.67,87.63 90 top
C3  29.21,87.63 90 top
C4  11.43,80.01 90 top
C5  20.95,66.67 0 top
C6  20.95,61.59 180 top
C7  58.42,6.35 90 top
C8  78.74,6.35 90 top
C9  68.58,6.35 90 top
C10  34.92,17.78 90 top
C11  38.73,17.78 90 top
C12  63.5,6.35 90 top
C13  72.39,43.18 90 top
C14  96.52,43.18 90 top
C15  20.32,29.84 0 top
C16  123.19,35.56 0 top  (outside the outline)
C17  135.89,40.01 0 top  (outside the outline)
C18  42.55,17.78 90 top
C19  39.37,67.31 90 top
C20  39.37,95.25 90 top
C21  64.77,95.25 90 top
C22  39.37,81.28 90 top
C23  6.35,80.01 90 top
C24  64.77,67.31 90 top
C25  64.77,81.28 90 top
CLK  13.34,46.99 180 top
CLOCK  6.35,43.81 90 top
CV_IN  6.35,31.11 90 top
CV_OUT  6.35,5.71 90 top
D2  20.32,27.3 0 top
D5  8.89,71.12 0 top
D6  8.89,55.88 180 top
F1  6.35,68.58 0 top
F2  6.35,58.42 0 top
FRONT_BUS  95.25,25.4 90 top
FRONT_BUS2  33.02,45.72 0 top
FRONT_PWR  33.66,28.57 90 top
GATES  76.2,55.88 180 bottom
IC7  31.75,64.77 180 top
IC11  88.27,60.96 270 top
IC12  89.53,85.09 0 top
L1  17.78,70.48 20 top
L2  17.78,57.15 340 top
LENGTH  45.72,37.47 0 top
NOISE-OUT  6.35,18.41 90 top
PULS1  28.57,21.59 180 top
PULSE_OUT  20.95,18.41 90 top
PULSES  50.8,55.88 180 bottom
R1  16.51,80.01 90 top
R2  5.08,37.47 0 top
R3  123.19,33.02 0 top  (outside the outline)
R4  33.02,54.61 0 top
R5  5.71,24.77 0 top
R6  33.02,57.15 0 top
R7  115.57,48.26 0 top  (outside the outline)
R8  36.83,86.36 90 top
R9  129.54,52.07 0 top  (outside the outline)
R10  115.57,45.72 0 top  (outside the outline)
R11  123.19,27.94 0 top  (outside the outline)
R12  129.54,49.53 0 top  (outside the outline)
R13  115.57,50.8 0 top  (outside the outline)
R14  24.13,87.63 90 top
R15  31.75,87.63 90 top
R16  13.97,80.01 90 top
R17  20.32,24.77 0 top
R18  81.28,6.35 90 top
R19  5.71,12.06 0 top
R20  60.96,6.35 90 top
R22  86.36,6.35 90 top
R23  83.82,6.35 90 top
R24  8.89,80.01 90 top
R26  129.54,46.99 0 top  (outside the outline)
R27  123.19,30.48 0 top  (outside the outline)
R28  71.12,6.35 90 top
R29  123.19,9.53 180 top  (outside the outline)
R30  76.2,6.35 90 top
R31  73.66,6.35 90 top
R32  66.04,6.35 90 top
R35  88.9,6.35 90 top
RN2  100.33,21.59 90 top
SHIFTREG_EXT  50.8,95.25 180 top
SHIFTREG_MAIN  76.2,95.25 180 top
SV1  8.89,63.5 180 bottom
SWITCH_IC  10.16,92.71 180 top
T1  2N3904  [TO92']  120.02,17.14 180 top  (outside the outline)
TL431  66.04,43.18 270 top
U1  53.98,17.78 180 top
U$1  [MOUNTING_HOLE]  95.25,55.88 0 top
U$2  84.45,43.18 180 top
U$3  [MOUNTING_HOLE]  24.13,97.79 0 top
U$4  [MOUNTING_HOLE]  24.13,45.72 0 top
U$5  [MOUNTING_HOLE]  95.25,3.81 0 top
VR1  38.1,6.35 90 top
VR2  77.47,24.77 270 top
VR3  22.86,6.35 270 top
WRITE  49.53,6.35 90 top

### Tracks (layer width: path | path; a pad name or v marks a point on that pad's centre or on a via)
+9V_1  (2 unrouted)
+9V_2  (2 unrouted)
+12V_BACK  (22 unrouted)
+12V_FRONT  (10 unrouted)
+12V_INLET  (3 unrouted)
-12V_BACK  (8 unrouted)
-12V_FRONT  (7 unrouted)
-12V_INLET  (3 unrouted)
B1_BACK  (4 unrouted)
B1_FRONT  (3 unrouted)
B2_BACK  (3 unrouted)
B2_FRONT  (2 unrouted)
B3_BACK  (3 unrouted)
B3_FRONT  (3 unrouted)
B4_BACK  (3 unrouted)
B4_FRONT  (3 unrouted)
B5_BACK  (4 unrouted)
B5_FRONT  (3 unrouted)
B6_BACK  (3 unrouted)
B6_FRONT  (3 unrouted)
B7_BACK  (3 unrouted)
B7_FRONT  (3 unrouted)
B8_BACK  (3 unrouted)
B8_FRONT  (2 unrouted)
BUFFCLK2_BACK  (3 unrouted)
BUFFCLK_BACK  (9 unrouted)
CLOCK_BACK  (6 unrouted)
CLOCK_FRONT  (4 unrouted)
END_OF_LOOP_BACK  (2 unrouted)
END_OF_LOOP_FRONT  (2 unrouted)
GATE1  (1 unrouted)
GATE2  (1 unrouted)
GATE3  (1 unrouted)
GATE4  (1 unrouted)
GATE5  (1 unrouted)
GATE6  (1 unrouted)
GATE7  (1 unrouted)
GATE8  (1 unrouted)
GND_BACK
  pour Bottom: -1.27,102.87 109.22,104.14 109.22,52.07 -1.27,50.8
GND_FRONT  (7 unrouted)
  pour Bottom: 0,50.8 107.95,50.8 107.95,-1.27 -1.27,-1.27 -1.27,50.8
LOOP_CTRL_BACK  (5 unrouted)
LOOP_CTRL_FRONT  (2 unrouted)
MAIN_OUT  (3 unrouted)
N$1  (1 unrouted)
N$2  (1 unrouted)
N$3  (1 unrouted)
N$4  (2 unrouted)
N$5  (4 unrouted)
N$6  (1 unrouted)
N$7  (2 unrouted)
N$8  (1 unrouted)
N$9  (1 unrouted)
N$10  (2 unrouted)
N$11  (1 unrouted)
N$12  (3 unrouted)
N$13  (3 unrouted)
N$14  (1 unrouted)
N$15  (1 unrouted)
N$16  (2 unrouted)
N$17  (2 unrouted)
N$18  (3 unrouted)
N$20  (1 unrouted)
N$21  (2 unrouted)
N$22  (2 unrouted)
N$23  (1 unrouted)
N$25  (1 unrouted)
N$26  (1 unrouted)
N$27  (3 unrouted)
N$28  (2 unrouted)
N$30  (1 unrouted)
N$31  (1 unrouted)
N$32  (1 unrouted)
N$33  (1 unrouted)
N$34  (1 unrouted)
N$35  (1 unrouted)
N$36  (1 unrouted)
N$37  (1 unrouted)
N$39  (1 unrouted)
N$40  (1 unrouted)
N$41  (4 unrouted)
N$42  (1 unrouted)
N$43  (1 unrouted)
N$44  (1 unrouted)
N$45  (2 unrouted)
N$47  (1 unrouted)
N$48  (1 unrouted)
NOISE_BACK  (1 unrouted)
NOISE_FRONT  (3 unrouted)
PULSE1  (2 unrouted)
PULSE2  (1 unrouted)
PULSE3  (1 unrouted)
PULSE4  (1 unrouted)
PULSE5  (1 unrouted)
PULSE6  (1 unrouted)
PULSE7  (1 unrouted)
PULSE8  (1 unrouted)
PULSE_OUT_BACK  (1 unrouted)
PULSE_OUT_FRONT  (2 unrouted)
START_OF_LOOP  (3 unrouted)
STEP_12_BACK  (3 unrouted)
STEP_12_FRONT  (1 unrouted)
STEP_16_BACK  (1 unrouted)
STEP_16_FRONT  (1 unrouted)
WRITE_SW_FRONT  (1 unrouted)

### Text on the board
bPlace: Music Thing Modular / / Turing Machine / Rev 4 / Prototype 2 / July 2015 / CC-BY-SA